# Altium schematic sheet Sensing.SchDoc
size A4; Revision: 1.0; SheetNumber: 3; SheetTotal: 5
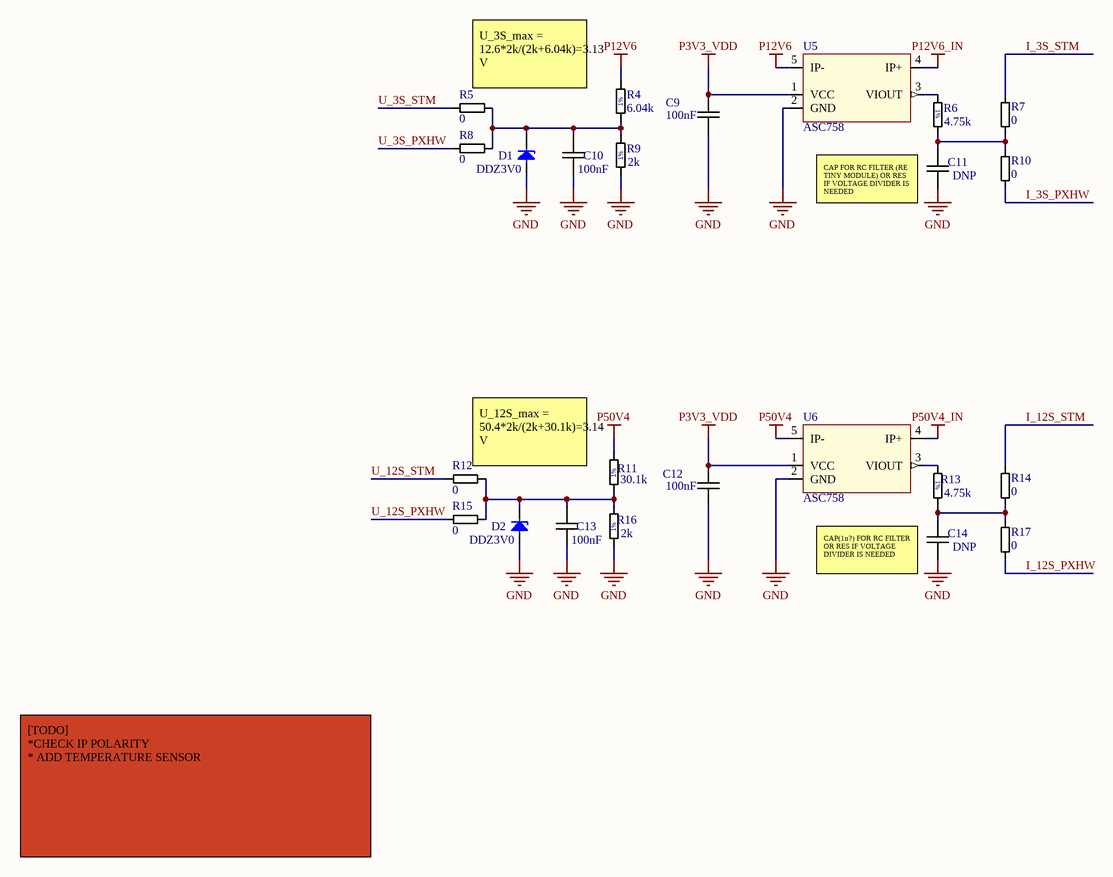
[diagram p0: Sensing.SchDoc]

## Parts
C9  100nF  [CAPC0603X90N]
C10  100nF  [CAPC0603X90N]
C11  DNP  [CAPC0603X90N]
C12  100nF  [CAPC0603X90N]
C13  100nF  [CAPC0603X90N]
C14  DNP  [CAPC0603X90N]
D1  DDZ3V0  [SOD323F-ZENER]
D2  DDZ3V0  [SOD323F-ZENER]
R4  6.04k  [RESC0603X60N]
R5  0  [RESC0603X60N]
R6  4.75k  [RESC0603X60N]
R7  0  [RESC0603X60N]
R8  0  [RESC0603X60N]
R9  2k  [RESC0603X60N]
R10  0  [RESC0603X60N]
R11  30.1k  [RESC0603X60N]
R12  0  [RESC0603X60N]
R13  4.75k  [RESC0603X60N]
R14  0  [RESC0603X60N]
R15  0  [RESC0603X60N]
R16  2k  [RESC0603X60N]
R17  0  [RESC0603X60N]
U5  ASC758  [PFF]
U6  ASC758  [PFF]

## Nets
GND: C9.1 C10.1 C11.1 C12.1 C13.1 C14.1 D1.2(A) D2.2(A) R9.1 R16.1 U5.2(GND) U6.2(GND)
P3V3_VDD: C9.2 C12.2 U5.1(VCC) U6.1(VCC)
P12V6: R4.2 U5.5(IP-)
P12V6_IN: U5.4(IP+)
P50V4: R11.2 U6.5(IP-)
P50V4_IN: U6.4(IP+)
I_3S_PXHW: R10.1
I_3S_STM: R7.2
I_12S_PXHW: R17.1
I_12S_STM: R14.2
U_3S_PXHW: R8.2
U_3S_STM: R5.2
U_12S_PXHW: R15.2
U_12S_STM: R12.2
NetC10_2: C10.2 D1.1(C) R4.1 R5.1 R8.1 R9.2
NetC11_2: C11.2 R6.2 R7.1 R10.2
NetC13_2: C13.2 D2.1(C) R11.1 R12.1 R15.1 R16.2
NetC14_2: C14.2 R13.2 R14.1 R17.2
NetR6_1: R6.1 U5.3(VIOUT)
NetR13_1: R13.1 U6.3(VIOUT)

## Notes on the sheet
- U_3S_max = 12.6*2k/(2k+6.04k)=3.13 V
- (near C11) CAP FOR RC FILTER (RE TINY MODULE) OR RES IF VOLTAGE DIVIDER IS NEEDED
- (near R12) U_12S_max = 50.4*2k/(2k+30.1k)=3.14 V
- (near C14) CAP(1n?) FOR RC FILTER OR RES IF VOLTAGE DIVIDER IS NEEDED
- [TODO]                                                                                                 *CHECK IP POLARITY                                                                      * ADD TEMPERATURE SENSOR
- Project:
- Variant:
- File:
- Sheet:
- Revision:
- Total Sheet:
- Politechnika Warszawska
- Wydział Elektryczny
- Pl. Politechniki 1
- Author:
- Piotr Czapnik
- Modified:
- 00-661 Warszawa

## Library data of the parts
C9 C10 C12 C13 = CC0603_100NF_16V_10%_X7R: Non-polarised capacitor; Manufacturer: GENERIC; Manufacturer 1 Example: Vishay; Manufacturer 1 Part Number: VJ0603Y104KXJCW1BC; Manufacturer 1 Component Height: 0.8mm; PressFit: No; Dielectric: X7R; Tolerance: 10%; Voltage: 16V; DesignItemId: CC0603_100NF_16V_10%_X7R; Author: KB; Case: 0603 (1608 metric); Component Kind: Standard; HelpURL: https://www.vishay.com/docs/28548/vjw1bcbascomseries.pdf; Manufacturer Part Number: CC0603_100NF_16V_10%_X7R; Mounted: Yes; Part Description: Non-polarised capacitor; Pin Count: 2; Sense: No; SMD: Yes; Socket: No; Status: Recommended; Value: 100nF; Supplier 1: Farnell; Supplier 2: TME; Supplier 3: Mouser; Create Date: 01.04.2019; LatestRevisionDate: 01.04.2019; Supplier Part Number 1: 2896425; Supplier Part Number 2: VJ0603Y104KXJCW1BC; Supplier Part Number 3: 710-885012206046
C11 C14 = CC0603_DNP: Non-polarised capacitor; Manufacturer: GENERIC; Manufacturer Part Number: UNDEFINED; Manufacturer 1 Component Height: 0.8mm; Mounted: No; PressFit: No; DesignItemId: CC0603_DNP; Author: KB; Case: 0603 (1608 metric); Component Kind: Standard; Part Description: Non-polarised capacitor; Pin Count: 2; Sense: No; SMD: Yes; Socket: No; Status: Recommended; Value: DNP; Create Date: 01.04.2019; LatestRevisionDate: 01.04.2019
D1 D2 = DDZ3V0BSF-7: Diode Zener, Uz 3.12V, 500mW; Manufacturer 1 Example: Diodes Incorporated; Manufacturer 1 Component Height: 0.7mm; PressFit: No; DesignItemId: DDZ3V0BSF-7; Author: PC; Device: DDZ3V0; Component Kind: Standard; Footprint: SOD323F; HelpURL: https://www.diodes.com/assets/Datasheets/ds31987.pdf; Manufacturer 1 Part Number: DDZ3V0BSF-7; Mounted: Yes; Part Description: Diode Zener, Uz 3.12V, 500mW; Pin Count: 2; Sense: No; SMD: Yes; Socket: No; Supplier 1: Mouser; Supplier 2: Digi-Key; Create Date: 18.03.2020; LatestRevisionDate: 18.03.2020; Supplier Part Number 2: DDZ3V0BSF-7DICT-ND; Supplier Part Number 1: 621-DDZ3V0BSF-7
R4 = R0603_6K04_0.1W_100PPM: General Purpose Thick Film Chip Resistor; Manufacturer: GENERIC; Manufacturer Part Number: R0603_6K04_0.0625W 0.1W 0.125W 0.25W 0.5W 1W 0.75W 1W_100PPM; Manufacturer 1 Example: Vishay; Manufacturer 1 Part Number: CRCW06036K04FKEDC; Manufacturer 1 Component Height: 0.5mm; Power: 100mW; Current Max: 0; PressFit: No; TC: ?100 ppm/?C; Tolerance: 1%; Voltage: 75V; DesignItemId: R0603_6K04_0.1W_100PPM; Author: KB; Case: 0603 (1608 metric); Component Kind: Standard; Component Type: Standard; HelpURL: https://www.vishay.com/docs/20035/dcrcwe3.pdf; Mounted: Yes; Part Description: General Purpose Thick Film Chip Resistor; Pin Count: 2; Sense: No; SMD: Yes; Socket: No; Status: Recommended; Value: 6.04k; Supplier 1: Farnell; Supplier 2: TME; Supplier 3: Mouser; Create Date: 03.07.2019; LatestRevisionDate: 03.07.2019
R5 R7 R8 R10 R12 R14 R15 R17 = R0603_0R_JUMPER: General Purpose Thick Film Chip Resistor; Manufacturer: GENERIC; Manufacturer 1 Example: Vishay; Manufacturer 1 Part Number: CRCW06030000Z0EDC; Manufacturer 1 Component Height: 0.5mm; Current Max: 2; PressFit: No; Tolerance: 20mOhm; Voltage: 75V; DesignItemId: R0603_0R_JUMPER; Author: KB; Case: 0603 (1608 metric); Component Kind: Standard; Component Type: Standard; HelpURL: https://www.vishay.com/docs/20035/dcrcwe3.pdf; Manufacturer Part Number: R0603_0R_JUMPER; Mounted: Yes; Part Description: General Purpose Thick Film Chip Resistor; Pin Count: 2; Power: -; Sense: No; SMD: Yes; Socket: No; Status: Recommended; TC: -; Value: 0; Supplier 1: Farnell; Supplier 2: TME; Supplier 3: Mouser; Create Date: 03.07.2019; LatestRevisionDate: 03.07.2019; Supplier Part Number 3: 71-CRCW06030000Z0EAC; Supplier Part Number 2: CRCW06030000Z0TABC; Supplier Part Number 1: 2616741
R6 R13 = R0603_4K75_0.1W_100PPM: General Purpose Thick Film Chip Resistor; Manufacturer: GENERIC; Manufacturer Part Number: R0603_4K75_0.0625W 0.1W 0.125W 0.25W 0.5W 1W 0.75W 1W_100PPM; Manufacturer 1 Example: Vishay; Manufacturer 1 Part Number: CRCW06034K75FKEDC; Manufacturer 1 Component Height: 0.5mm; Power: 100mW; Current Max: 0; PressFit: No; TC: ?100 ppm/?C; Tolerance: 1%; Voltage: 75V; DesignItemId: R0603_4K75_0.1W_100PPM; Author: KB; Case: 0603 (1608 metric); Component Kind: Standard; Component Type: Standard; HelpURL: https://www.vishay.com/docs/20035/dcrcwe3.pdf; Mounted: Yes; Part Description: General Purpose Thick Film Chip Resistor; Pin Count: 2; Sense: No; SMD: Yes; Socket: No; Status: Recommended; Value: 4.75k; Supplier 1: Farnell; Supplier 2: TME; Supplier 3: Mouser; Create Date: 03.07.2019; LatestRevisionDate: 03.07.2019
R9 R16 = R0603_2K00_0.1W_100PPM: General Purpose Thick Film Chip Resistor; Manufacturer: GENERIC; Manufacturer Part Number: R0603_2K00_0.0625W 0.1W 0.125W 0.25W 0.5W 1W 0.75W 1W_100PPM; Manufacturer 1 Example: Vishay; Manufacturer 1 Part Number: CRCW06032K00FKEDC; Manufacturer 1 Component Height: 0.5mm; Power: 100mW; Current Max: 0; PressFit: No; TC: ?100 ppm/?C; Tolerance: 1%; Voltage: 75V; DesignItemId: R0603_2K00_0.1W_100PPM; Author: KB; Case: 0603 (1608 metric); Component Kind: Standard; Component Type: Standard; HelpURL: https://www.vishay.com/docs/20035/dcrcwe3.pdf; Mounted: Yes; Part Description: General Purpose Thick Film Chip Resistor; Pin Count: 2; Sense: No; SMD: Yes; Socket: No; Status: Recommended; Value: 2k; Supplier 1: Farnell; Supplier 2: TME; Supplier 3: Mouser; Create Date: 03.07.2019; LatestRevisionDate: 03.07.2019
R11 = R0603_30K1_0.1W_100PPM: General Purpose Thick Film Chip Resistor; Manufacturer: GENERIC; Manufacturer Part Number: R0603_30K1_0.0625W 0.1W 0.125W 0.25W 0.5W 1W 0.75W 1W_100PPM; Manufacturer 1 Example: Vishay; Manufacturer 1 Part Number: CRCW060330K1FKEDC; Manufacturer 1 Component Height: 0.5mm; Power: 100mW; Current Max: 0; PressFit: No; TC: ?100 ppm/?C; Tolerance: 1%; Voltage: 75V; DesignItemId: R0603_30K1_0.1W_100PPM; Author: KB; Case: 0603 (1608 metric); Component Kind: Standard; Component Type: Standard; HelpURL: https://www.vishay.com/docs/20035/dcrcwe3.pdf; Mounted: Yes; Part Description: General Purpose Thick Film Chip Resistor; Pin Count: 2; Sense: No; SMD: Yes; Socket: No; Status: Recommended; Value: 30.1k; Supplier 1: Farnell; Supplier 2: TME; Supplier 3: Mouser; Create Date: 03.07.2019; LatestRevisionDate: 03.07.2019
U5 U6 = ASC758: Hall-Effect-Based / Linear Current Sensor IC with 100 µ? Current Conductor; Manufacturer 1 Example: Allegro; Manufacturer 1 Part Number: ACS758ECB-200B-PFF-T; Manufacturer 1 Component Height: 7mm; PressFit: No; DesignItemId: ASC758; Author: PC; Device: ASC758; Component Kind: Standard; Footprint: Allegro custom CA/CB; HelpURL: http://elty.pl/upload/download/ACS758-Datasheet.pdf; Mounted: Yes; Part Description: Hall-Effect-Based / Linear Current Sensor IC with 100 µ? Current Conductor; Pin Count: 5; Sense: Yes; SMD: No; Socket: No; Supplier 1: Farnell; Supplier 2: Digi-Key; Create Date: 10.03.2020; LatestRevisionDate: 10.03.2020; Supplier Part Number 1: 1791391; Supplier Part Number 2: 620-1323-ND